# Altium schematic sheet ODrive.SchDoc
size A4; Organization: Altium Limited; Address1: L3, 12a Rodborough Rd; Address2: Frenchs Forest; Address3: NSW; Address4: Australia 2086
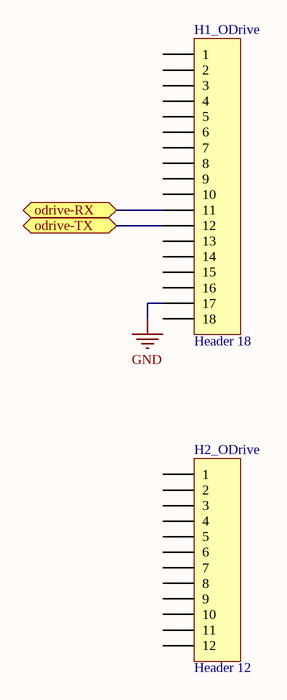
[diagram p0: ODrive.SchDoc]

## Parts
H1_ODrive  Header 18  [HDR1X18]
H2_ODrive  Header 12  [HDR1X12]

## Ports
odrive-RX, odrive-TX

## Nets
GND: H1_ODrive.17
odrive-RX: H1_ODrive.11 ; port odrive-RX
odrive-TX: H1_ODrive.12 ; port odrive-TX

Not connected (* = marked no-connect by the designer): H1_ODrive 1 2 3 4 5 6 7 8 9 10 13 14 15 16 18; H2_ODrive 1 2 3 4 5 6 7 8 9 10 11 12

## Notes on the sheet
- Title
- Size:
- Date:
- A4
- Number:
- Time:
- Revision:
- Sheet
- of
- File:

## Library data of the parts
H1_ODrive = Header 18: Header, 18-Pin; LatestRevisionDate: 17-Jul-2002; LatestRevisionNote: Re-released for DXP Platform.; Publisher: Altium Limited
H2_ODrive = Header 12: Header, 12-Pin; LatestRevisionDate: 17-Jul-2002; LatestRevisionNote: Re-released for DXP Platform.; Publisher: Altium Limited